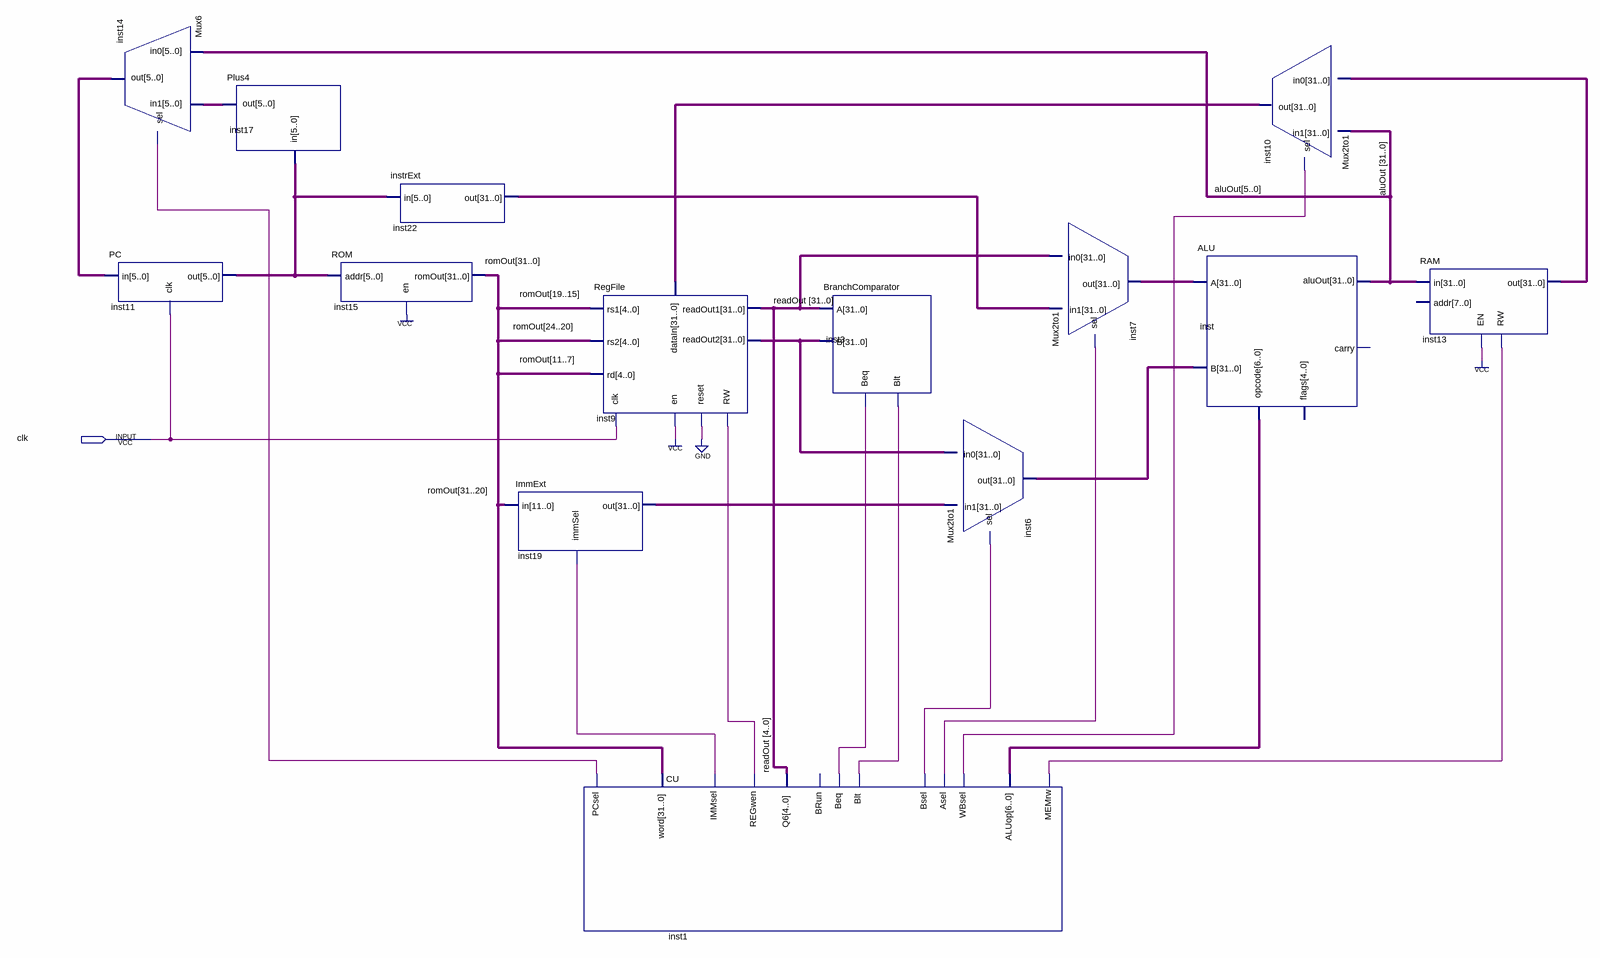
[diagram p0: schematic sheet]
// Quartus schematic FINAL.bdf as structural Verilog: 14 symbols, 1 pins
module FINAL (
  input  clk
);

  wire inst1_asel, inst1_bsel, inst1_immsel, inst1_memrw, inst1_pcsel, inst1_regwen, inst1_wbsel, inst3_beq,
       inst3_blt;
  wire [5:0] inst11_out, inst14_out, inst17_out;
  wire [6:0] inst1_aluop;
  wire [31:0] aluOut, inst6_out, inst7_out, inst9_readout2, inst10_out, inst13_out, inst19_out, inst22_out,
       readOut, romOut;

  PC inst11 (.in(inst14_out), .clk(clk), .out(inst11_out));
  Mux6 inst14 (.in0(aluOut[5:0]), .in1(inst17_out), .sel(inst1_pcsel), .out(inst14_out));
  Plus4 inst17 (.in(inst11_out), .out(inst17_out));
  ROM inst15 (.addr(inst11_out), .en(1'b1), .romOut(romOut));
  instrExt inst22 (.in(inst11_out), .out(inst22_out));
  ImmExt inst19 (.in(romOut[31:20]), .immSel(inst1_immsel), .out(inst19_out));
  CU inst1 (
    .word(romOut), .Q6(readOut[4:0]), .Beq(inst3_beq), .Blt(inst3_blt), .Bsel(inst1_bsel), .Asel(inst1_asel),
    .PCsel(inst1_pcsel), .REGwen(inst1_regwen), .IMMsel(inst1_immsel), .ALUop(inst1_aluop),
    .WBsel(inst1_wbsel), .MEMrw(inst1_memrw));  // open: BRun
  RegFile inst9 (
    .rs1(romOut[19:15]), .rs2(romOut[24:20]), .rd(romOut[11:7]), .RW(inst1_regwen), .dataIn(inst10_out),
    .en(1'b1), .clk(clk), .reset(1'b0), .readOut1(readOut), .readOut2(inst9_readout2));
  BranchComparator inst3 (.A(readOut), .B(inst9_readout2), .Beq(inst3_beq), .Blt(inst3_blt));
  Mux2to1 inst6 (.in0(inst9_readout2), .in1(inst19_out), .sel(inst1_bsel), .out(inst6_out));
  Mux2to1 inst7 (.in0(readOut), .in1(inst22_out), .sel(inst1_asel), .out(inst7_out));
  ALU inst (.A(inst7_out), .B(inst6_out), .opcode(inst1_aluop), .aluOut(aluOut));  // open: carry, flags
  Mux2to1 inst10 (.in0(inst13_out), .in1(aluOut), .sel(inst1_wbsel), .out(inst10_out));
  RAM inst13 (.RW(inst1_memrw), .EN(1'b1), .in(aluOut), .out(inst13_out));  // open: addr
endmodule
